# Altium schematic sheet Main_005.SchDoc: 230W E-bike charger
size 431 x 279 mm; Author: Vantage Power; Engineer: Kaone Bogopa; Organization: Vantage Power; Address1: ADDRESS 1; Address2: ADDRESS 2; Address3: ADDRESS 3; Address4: ADDRESS 4; Revision: -; ENG_APP_DATE: --/--/--; DSN_APP_DATE: --/--/--; CHK_APP_DATE: --/--/--; ImagePath: C:\Users\kbogo\OneDrive - Vantage Power\Documents\Logos\vantage-power.png; Application_BuildNumber: 2
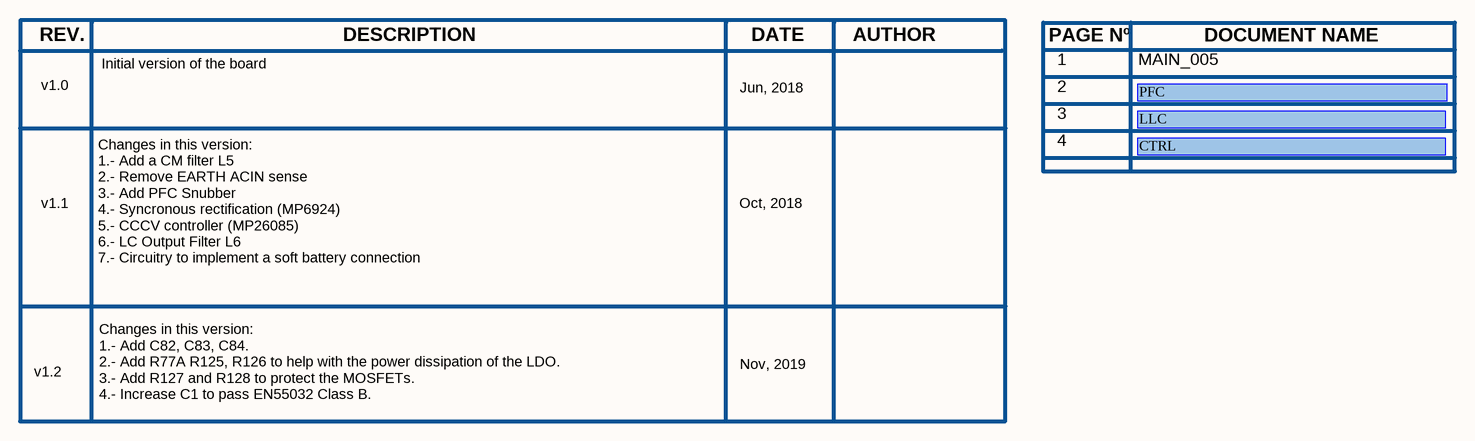
[diagram p0: Main_005.SchDoc]

## Sub-sheets
CTRL = CTRL.SchDoc: no entries
LLC = LLC.SchDoc: no entries
PFC = PFC.SchDoc: no entries

## Notes on the sheet
- REV.
- DESCRIPTION
- DATE
- AUTHOR
- PAGE Nº
- 1
- MAIN_005
- DOCUMENT NAME
- v1.0
- Initial version of the board
- Jun, 2018
- 2
- 3
- 4
- v1.1
- Oct, 2018
- Changes in this version:
  1.- Add a CM filter L5
  2.- Remove EARTH ACIN sense
  3.- Add PFC Snubber
  4.- Syncronous rectification (MP6924)
  5.- CCCV controller (MP26085)
  6.- LC Output Filter L6
  7.- Circuitry to implement a soft battery connection
- v1.2
- Changes in this version:
  1.- Add C82, C83, C84.
  2.- Add R77A R125, R126 to help with the power dissipation of the LDO.
  3.- Add R127 and R128 to protect the MOSFETs.
  4.- Increase C1 to pass EN55032 Class B.
- Nov, 2019
- DWG. NO.
- SHT.
- THIS DOCUMENT AND THE DATA DISCLOSED HEREIN OR HEREWITH IS THE PROPERTY OF ALTIUM LIMITED AND MAY BE FREELY DISTRIBUTED IN WHOLE. NO RIGHTS ARE RESERVED OR EXPRESS OR IMPLIED WARANTEE GIVEN.
- REVISION
- APPROVED
- ENG:
- APPROVALS
- PROJECT
- DSN:
- CHK:
- REFERENCE DOCUMENTS
- PROJECT REVISION:
- TITLE
- DOCUMENT REVISION:
- DESIGN ITEM:
- BOM:
- FAB DWG:
- PCB DWG:
- ASSY DWG:
- SCALE:
- SIZE
- B
- CAGE CODE
- FILE NAME
- DWG NO.
- SHEET
- OF
- REV